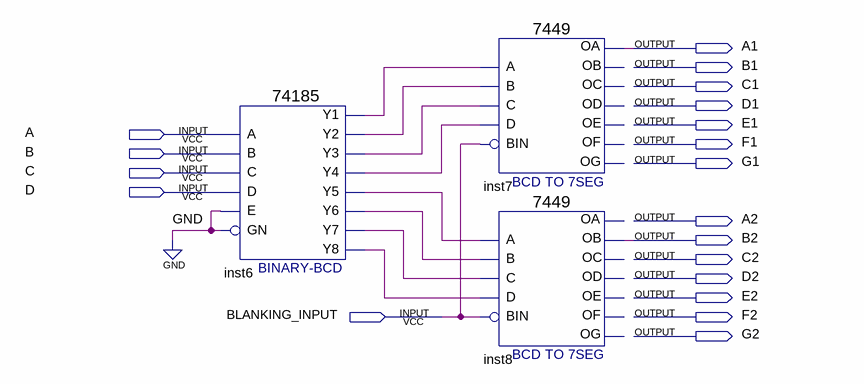
[diagram p0: schematic sheet]
// Quartus schematic 4bitBinaryToDual7Seg.bdf as structural Verilog: 3 symbols, 19 pins
module \4bitBinaryToDual7Seg  (
  input  A,
  input  B,
  input  C,
  input  D,
  input  BLANKING_INPUT,
  output A1,
  output B1,
  output C1,
  output D1,
  output E1,
  output F1,
  output G1,
  output A2,
  output B2,
  output C2,
  output D2,
  output E2,
  output F2,
  output G2
);

  wire inst6_y1, inst6_y2, inst6_y3, inst6_y4, inst6_y5, inst6_y6, inst6_y7, inst6_y8;

  \74185  inst6 (
    .A(A), .B(B), .D(D), .C(C), .E(1'b0), .GN(1'b0), .Y1(inst6_y1), .Y3(inst6_y3), .Y2(inst6_y2),
    .Y5(inst6_y5), .Y4(inst6_y4), .Y6(inst6_y6), .Y8(inst6_y8), .Y7(inst6_y7));
  \7449  inst7 (
    .A(inst6_y1), .C(inst6_y3), .B(inst6_y2), .D(inst6_y4), .BIN(BLANKING_INPUT), .OA(A1));  // open: OC, OD, OF, OG, OB, OE
  \7449  inst8 (
    .A(inst6_y5), .C(inst6_y7), .B(inst6_y6), .D(inst6_y8), .BIN(BLANKING_INPUT), .OB(B2));  // open: OC, OD, OF, OG, OA, OE
endmodule
